# Altium project NBBC95水表.PrjPCB
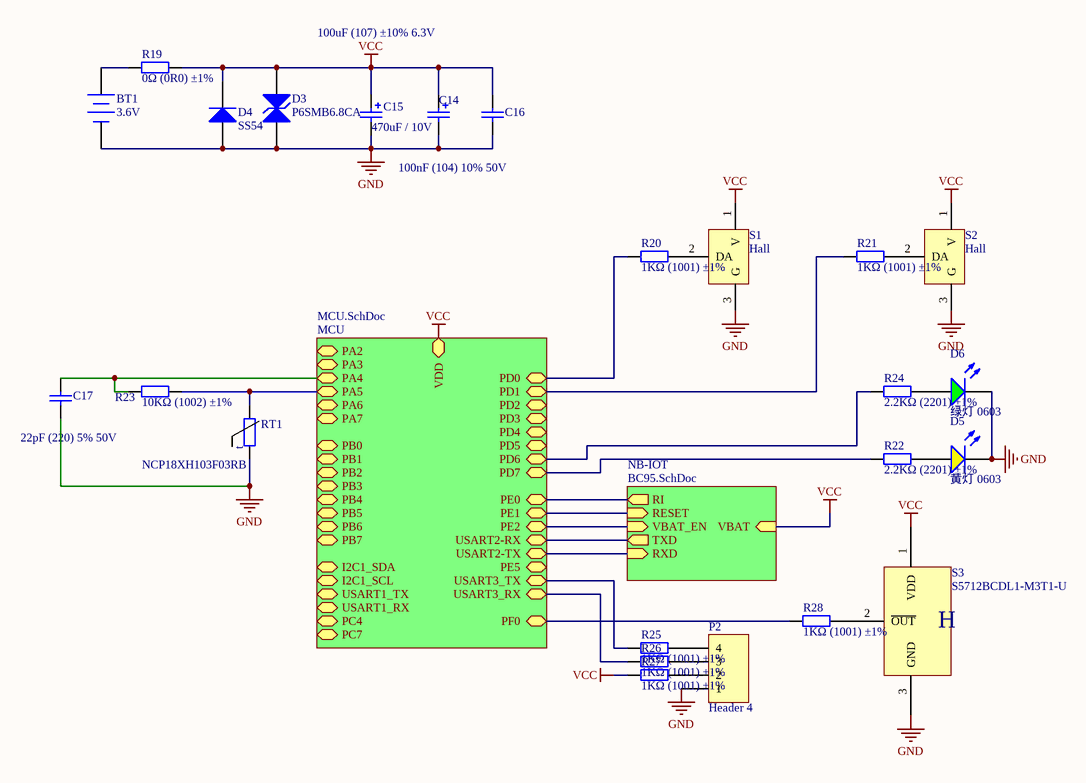
[diagram p0: NBBC95水表.SchDoc]
3 sheets, 71 parts. Net scope: hierarchical (ports join the sheet entries above them; power ports are global).
Board files: NBIOT水表主板.PcbDoc, 霍尔IC转接板.PcbDoc
Sheets:
  NBBC95水表.SchDoc
    MCU = MCU.SchDoc
    NB-IOT = BC95.SchDoc

## Sheet NBBC95水表.SchDoc
size A4

### Parts
BT1  3.6V  [电池连接焊线]
C14  100uF (107) ±10% 6.3V  [CASE-B_3528]
C15  470uF / 10V  [CASE-E_7343]
C16  100nF (104) 10% 50V  [0603_C]
C17  22pF (220) 5% 50V  [0603_C]
D3  P6SMB6.8CA  [SMB(DO-214AA)_S1]
D4  SS54  [SMA(DO-214AC)_S1]
D5  黄灯 0603  [0603_LED_S1]
D6  绿灯 0603  [0603_LED_S1]
P2  Header 4  [HDR1X4]
R19  0Ω (0R0) ±1%  [0805_R]
R20  1KΩ (1001) ±1%  [0603_R]
R21  1KΩ (1001) ±1%  [0603_R]
R22  2.2KΩ (2201) ±1%  [0603_R]
R23  10KΩ (1002) ±1%  [0603_R]
R24  2.2KΩ (2201) ±1%  [0603_R]
R25  1KΩ (1001) ±1%  [0603_R]
R26  1KΩ (1001) ±1%  [0603_R]
R27  1KΩ (1001) ±1%  [0603_R]
R28  1KΩ (1001) ±1%  [0603_R]
RT1  NCP18XH103F03RB  [0603_R]
S1  Hall  [霍尔转接板]
S2  Hall  [霍尔转接板]
S3  S5712BCDL1-M3T1-U  [SOT-23]

### Sub-sheets
MCU = MCU.SchDoc: PA2 (bidir), PA3 (bidir), PA4 (bidir), PA5 (bidir), PA6 (bidir), PA7 (bidir), PE0 (bidir), PE1 (bidir), PE2 (bidir), USART2-RX (bidir), USART2-TX (bidir), PE5 (bidir), PD0 (bidir), PD1 (bidir), PD2 (bidir), PD3 (bidir), PB0 (bidir), PB1 (bidir), PB2 (bidir), PB3 (bidir), PB4 (bidir), PB5 (bidir), PB6 (bidir), PB7 (bidir), PF0 (bidir), PD4 (bidir), PD5 (bidir), PD6 (bidir), PD7 (bidir), I2C1_SDA (bidir), I2C1_SCL (bidir), USART1_RX (bidir), USART1_TX (bidir), PC4 (bidir), PC7 (bidir), USART3_TX (bidir), USART3_RX (bidir), VDD
NB-IOT = BC95.SchDoc: VBAT (in), RESET (in), RXD (in), TXD (out), RI (out), VBAT_EN (in)

### Nets
GND: BT1.2(-) C14.2 C15.2 C16.2 C17.1 D3.1(A) D4.1(A) D5.K D6.K P2.1 RT1.1 S1.3(G) S2.3(G) S3.3(GND)
VCC: C14.1 C15.1 C16.1 D3.2(K) D4.2(K) R19.2 R27.2 S1.1(V) S2.1(V) S3.1(VDD) ; sheet MCU/VDD, sheet NB-IOT/VBAT
NetBT1_1: BT1.1(+) R19.1
NetC17_2: C17.2 R23.1 ; sheet MCU/PA4
NetD2_2: sheet MCU/USART2-TX, sheet NB-IOT/RXD
NetD5_A: D5.A R22.2
NetD6_A: D6.A R24.2
NetP2_2: P2.2 R27.1
NetP2_3: P2.3 R26.1
NetP2_4: P2.4 R25.1
NetQ4_3: sheet MCU/USART2-RX, sheet NB-IOT/TXD
NetQ5_3: sheet MCU/PE0, sheet NB-IOT/RI
NetR4_1: sheet MCU/PE2, sheet NB-IOT/VBAT_EN
NetR15_1: sheet MCU/PE1, sheet NB-IOT/RESET
NetR20_1: R20.1 ; sheet MCU/PD0
NetR20_2: R20.2 S1.2(DA)
NetR21_1: R21.1 ; sheet MCU/PD1
NetR21_2: R21.2 S2.2(DA)
NetR22_1: R22.1 ; sheet MCU/PD7
NetR23_2: R23.2 RT1.2 ; sheet MCU/PA5
NetR24_1: R24.1 ; sheet MCU/PD6
NetR25_2: R25.2 ; sheet MCU/USART3_TX
NetR26_2: R26.2 ; sheet MCU/USART3_RX
NetR28_1: R28.1 ; sheet MCU/PF0
NetR28_2: R28.2 S3.2(~{OUT})

### Notes on the sheet
- (in symbol NCP18XH103F03RB) t
- (in symbol S5712) H

### Library data of the parts
BT1 = Battery: 功率型锂电池; Published: 24-Mar-1999; LatestRevisionDate: 17-Jul-2002; LatestRevisionNote: Re-released for DXP Platform.; PackageReference: BAT-2; Publisher: Altium Limited
C14 = 3528 100uF (107) 10% 6.3V: 钽电容; ComponentLink1Description: 供应商链接; ComponentLink1URL: http://www.szlcsc.com/product/details_16815.html; Package: 3528; Supplier: LC; SuppliersPartNumber: C16133
C15 = 法拉电容 0.5F: 钽电容; ComponentLink1Description: 供应商链接; ComponentLink1URL: http://www.szlcsc.com/product/details_16815.html; Package: 3528; Supplier: LC; SuppliersPartNumber: C16133
C16 = 0603 100nF (104) 10% 50V: 贴片电容; ComponentLink1Description: 供应商链接; ComponentLink1URL: http://www.szlcsc.com/product/details_15331.html; Package: 0603; Supplier: LC; SuppliersPartNumber: C14663
C17 = 0603 22pF (220) 5% 50V: 贴片电容; ComponentLink1Description: 供应商链接; ComponentLink1URL: http://www.szlcsc.com/product/details_2005.html; Package: 0603; Supplier: LC; SuppliersPartNumber: C1653
D3 = SMB/DO-214AA P6SMB6.8CA: TVS; ComponentLink1Description: 供应商链接; ComponentLink1URL: http://www.szlcsc.com/product/details_79530.html; Package: SMB/DO-214AA; Supplier: LC; SuppliersPartNumber: C78395
D4 = SMA(DO-214AC) SS54: 二极管; ComponentLink1Description: 供应商链接; ComponentLink1URL: http://www.szlcsc.com/product/details_23178.html; Package: SMA(DO-214AC); Supplier: LC; SuppliersPartNumber: C22452
D5 = 0603 黄灯: 发光二极管; ComponentLink1Description: 供应商链接; ComponentLink1URL: http://www.szlcsc.com/product/details_73147.html; Package: 0603; Supplier: LC; SuppliersPartNumber: C72038
D6 = 0603 绿灯: 发光二极管; ComponentLink1Description: 供应商链接; ComponentLink1URL: http://www.szlcsc.com/product/details_73152.html; Package: 0603; Supplier: LC; SuppliersPartNumber: C72043
P2 = Header 4: Header, 4-Pin; LatestRevisionDate: 17-Jul-2002; LatestRevisionNote: Re-released for DXP Platform.; Publisher: Altium Limited
R19 = 0805 0Ω (0R0) 1%: 贴片电阻; ComponentLink1Description: 供应商链接; ComponentLink1URL: http://www.szlcsc.com/product/details_18165.html; Package: 0805; Supplier: LC; SuppliersPartNumber: C17477
R20 R21 R25-R28 = 0603 1KΩ (1001) 1%: 贴片电阻; ComponentLink1Description: 供应商链接; ComponentLink1URL: http://www.szlcsc.com/product/details_21904.html; Package: 0603; Supplier: LC; SuppliersPartNumber: C21190
R22 R24 = 0603 2.2KΩ (2201) 1%: 贴片电阻; ComponentLink1Description: 供应商链接; ComponentLink1URL: http://www.szlcsc.com/product/details_4597.html; Package: 0603; Supplier: LC; SuppliersPartNumber: C4190
R23 = 0603 10KΩ (1002) 1%: 贴片电阻; ComponentLink1Description: 供应商链接; ComponentLink1URL: http://www.szlcsc.com/product/details_26547.html; Package: 0603; Supplier: LC; SuppliersPartNumber: C25804
RT1 = NCP18XH103F03RB: 热敏电阻
S1 S2 = 霍尔开关转接板
S3 = S5712

## Sheet MCU.SchDoc
size A4
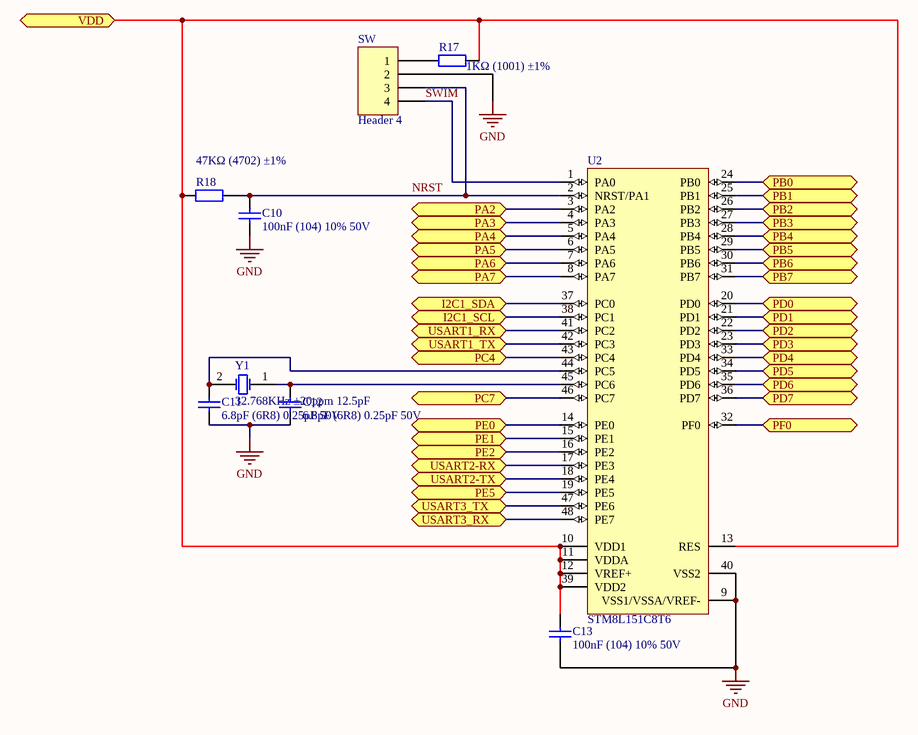
[diagram p1: MCU.SchDoc]

### Parts
C10  100nF (104) 10% 50V  [0603_C]
C11  6.8pF (6R8) 0.25pF 50V  [0603_C]
C12  6.8pF (6R8) 0.25pF 50V  [0603_C]
C13  100nF (104) 10% 50V  [0603_C]
R17  1KΩ (1001) ±1%  [0603_R]
R18  47KΩ (4702) ±1%  [0603_R]
SW  Header 4  [HDR1X4]
U2  STM8L151C8T6  [LQFP48_M]
Y1  32.768KHz ±20ppm 12.5pF  [SMD-3215_2P FC - 135]

### Ports
I2C1_SCL (bidir), I2C1_SDA (bidir), PA2 (bidir), PA3 (bidir), PA4 (bidir), PA5 (bidir), PA6 (bidir), PA7 (bidir), PB0 (bidir), PB1 (bidir), PB2 (bidir), PB3 (bidir), PB4 (bidir), PB5 (bidir), PB6 (bidir), PB7 (bidir), PC4 (bidir), PC7 (bidir), PD0 (bidir), PD1 (bidir), PD2 (bidir), PD3 (bidir), PD4 (bidir), PD5 (bidir), PD6 (bidir), PD7 (bidir), PE0 (bidir), PE1 (bidir), PE2 (bidir), PE5 (bidir), PF0 (bidir), USART1_RX (bidir), USART1_TX (bidir), USART2-RX (bidir), USART2-TX (bidir), USART3_RX (bidir), USART3_TX (bidir), VDD

### Nets
GND: C10.1 C11.1 C12.1 C13.1 SW.2 U2.9(VSS1/VSSA/VREF-) U2.40(VSS2)
VCC: C13.2 R17.2 R18.2 U2.10(VDD1) U2.11(VDDA) U2.12(VREF+) U2.13(RES) U2.39(VDD2) ; port VDD
NRST: C10.2 R18.1 SW.3 U2.2(NRST/PA1)
SWIM: SW.4 U2.1(PA0)
NetC11_2: C11.2 U2.44(PC5) Y1.2(OSC2)
NetC12_2: C12.2 U2.45(PC6) Y1.1(OSC1)
NetC17_2: U2.5(PA4) ; port PA4
NetD2_2: U2.18(PE4) ; port USART2-TX
NetQ4_3: U2.17(PE3) ; port USART2-RX
NetQ5_3: U2.14(PE0) ; port PE0
NetR4_1: U2.16(PE2) ; port PE2
NetR15_1: U2.15(PE1) ; port PE1
NetR17_1: R17.1 SW.1
NetR20_1: U2.20(PD0) ; port PD0
NetR21_1: U2.21(PD1) ; port PD1
NetR22_1: U2.36(PD7) ; port PD7
NetR23_2: U2.6(PA5) ; port PA5
NetR24_1: U2.35(PD6) ; port PD6
NetR25_2: U2.47(PE6) ; port USART3_TX
NetR26_2: U2.48(PE7) ; port USART3_RX
NetR28_1: U2.32(PF0) ; port PF0
NetU2_3: U2.3(PA2) ; port PA2
NetU2_4: U2.4(PA3) ; port PA3
NetU2_7: U2.7(PA6) ; port PA6
NetU2_8: U2.8(PA7) ; port PA7
NetU2_19: U2.19(PE5) ; port PE5
NetU2_22: U2.22(PD2) ; port PD2
NetU2_23: U2.23(PD3) ; port PD3
NetU2_24: U2.24(PB0) ; port PB0
NetU2_25: U2.25(PB1) ; port PB1
NetU2_26: U2.26(PB2) ; port PB2
NetU2_27: U2.27(PB3) ; port PB3
NetU2_28: U2.28(PB4) ; port PB4
NetU2_29: U2.29(PB5) ; port PB5
NetU2_30: U2.30(PB6) ; port PB6
NetU2_31: U2.31(PB7) ; port PB7
NetU2_33: U2.33(PD4) ; port PD4
NetU2_34: U2.34(PD5) ; port PD5
NetU2_37: U2.37(PC0) ; port I2C1_SDA
NetU2_38: U2.38(PC1) ; port I2C1_SCL
NetU2_41: U2.41(PC2) ; port USART1_RX
NetU2_42: U2.42(PC3) ; port USART1_TX
NetU2_43: U2.43(PC4) ; port PC4
NetU2_46: U2.46(PC7) ; port PC7

### Library data of the parts
C10 C13 = 0603 100nF (104) 10% 50V: 贴片电容; ComponentLink1Description: 供应商链接; ComponentLink1URL: http://www.szlcsc.com/product/details_15331.html; Package: 0603; Supplier: LC; SuppliersPartNumber: C14663
C11 C12 = 0603 6.8pF (6R8) 0.25pF 50V: 贴片电容; ComponentLink1Description: 供应商链接; ComponentLink1URL: http://www.szlcsc.com/product/details_2031.html; Package: 0603; Supplier: LC; SuppliersPartNumber: C1679
R17 = 0603 1KΩ (1001) 1%: 贴片电阻; ComponentLink1Description: 供应商链接; ComponentLink1URL: http://www.szlcsc.com/product/details_21904.html; Package: 0603; Supplier: LC; SuppliersPartNumber: C21190
R18 = 0603 100KΩ (1003) 1%: 贴片电阻; ComponentLink1Description: 供应商链接; ComponentLink1URL: http://www.szlcsc.com/product/details_26546.html; Package: 0603; Supplier: LC; SuppliersPartNumber: C25803
SW = Header 4: Header, 4-Pin; LatestRevisionDate: 17-Jul-2002; LatestRevisionNote: Re-released for DXP Platform.; Publisher: Altium Limited
U2 = STM8L151C8T6: STM8L ARM-based EnergyLite 8-bit MCU, 64 kB Flash, 4 kB Internal RAM, -40 to +85°C Temperature, 48-pin LQFP, Tray; PackageVersion: rev13, Apr-2011; PackageReference: LQFP48; PackageDescription: 48-Pin Low-Profile Quad Flat Pack, 7 x 7 mm Body, 0.5 mm Pitch (LQFP48); ComponentLink1Description: Manufacturer URL; ComponentLink1URL: http://www.st.com/; ComponentLink2Description: STM8L151/152,x8,R6 Datasheet; ComponentLink2URL: http://www.st.com/internet/com/TECHNICAL_RESOURCES/TECHNICAL_LITERATURE/DATASHEET/CD00284933.pdf; ComponentLink3Description: STM8L Family Web Page; ComponentLink3URL: http://www.st.com/internet/mcu/subclass/1381.jsp
Y1 = SMD-3215_2P 32.768KHz 20ppm 12.5pF: 贴片晶振; ComponentLink1Description: 供应商链接; ComponentLink1URL: http://www.szlcsc.com/product/details_33310.html; Package: SMD-3215_2P; Supplier: LC; SuppliersPartNumber: C32346

## Sheet BC95.SchDoc
size A4
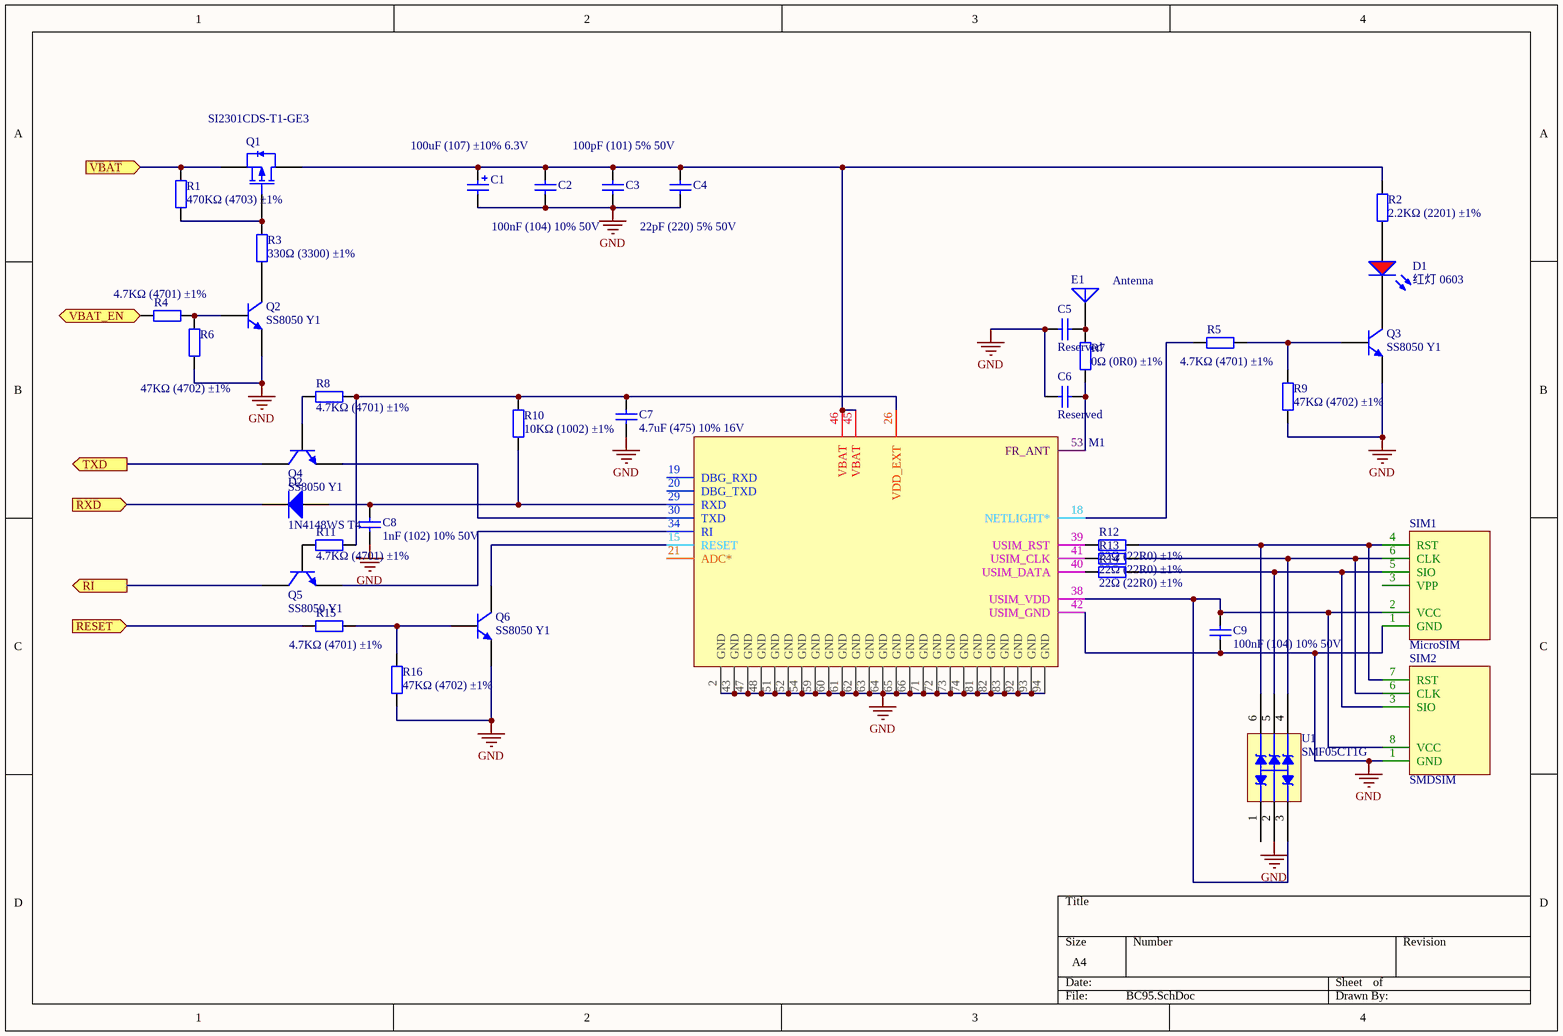
[diagram p2: BC95.SchDoc]

### Parts
C1  100uF (107) ±10% 6.3V  [CASE-B_3528]
C2  100nF (104) 10% 50V  [0603_C]
C3  100pF (101) 5% 50V  [0603_C]
C4  22pF (220) 5% 50V  [0603_C]
C5  Reserved  [0603_C]
C6  Reserved  [0603_C]
C7  4.7uF (475) 10% 16V  [0603_C]
C8  1nF (102) 10% 50V  [0603_C]
C9  100nF (104) 10% 50V  [0603_C]
D1  红灯 0603  [0603_LED_S1]
D2  1N4148WS T4  [SOD-323]
E1  Antenna  [PIN1]
M1  BC95-B5  [BC95-B]  (value not drawn)
Q1  SI2301CDS-T1-GE3  [SOT-23(SOT-23-3)]
Q2  SS8050 Y1  [SOT-23(SOT-23-3)]
Q3  SS8050 Y1  [SOT-23(SOT-23-3)]
Q4  SS8050 Y1  [SOT-23(SOT-23-3)]
Q5  SS8050 Y1  [SOT-23(SOT-23-3)]
Q6  SS8050 Y1  [SOT-23(SOT-23-3)]
R1  470KΩ (4703) ±1%  [0603_R]
R2  2.2KΩ (2201) ±1%  [0603_R]
R3  330Ω (3300) ±1%  [0603_R]
R4  4.7KΩ (4701) ±1%  [0603_R]
R5  4.7KΩ (4701) ±1%  [0603_R]
R6  47KΩ (4702) ±1%  [0603_R]
R7  0Ω (0R0) ±1%  [0603_R]
R8  4.7KΩ (4701) ±1%  [0603_R]
R9  47KΩ (4702) ±1%  [0603_R]
R10  10KΩ (1002) ±1%  [0603_R]
R11  4.7KΩ (4701) ±1%  [0603_R]
R12  22Ω (22R0) ±1%  [0603_R]
R13  22Ω (22R0) ±1%  [0603_R]
R14  22Ω (22R0) ±1%  [0603_R]
R15  4.7KΩ (4701) ±1%  [0603_R]
R16  47KΩ (4702) ±1%  [0603_R]
SIM1  MicroSIM  [SIM-01A]
SIM2  SMDSIM  [VQFN48]
U1  SMF05CT1G  [SC-70-6(SOT-363)]

### Ports
RESET (in), RI (out), RXD (in), TXD (out), VBAT (in), VBAT_EN (in)

### Nets
GND: C1.2 C2.2 C3.1 C4.1 C5.1 C6.1 C7.1 C8.1 C9.1 M1.2(GND) M1.42(USIM_GND) M1.43(GND) M1.47(GND) M1.48(GND) M1.51(GND) M1.52(GND) M1.54(GND) M1.59(GND) M1.60(GND) M1.61(GND) M1.62(GND) M1.63(GND) M1.64(GND) M1.65(GND) M1.66(GND) M1.71(GND) M1.72(GND) M1.73(GND) M1.74(GND) M1.81(GND) M1.82(GND) M1.83(GND) M1.92(GND) M1.93(GND) M1.94(GND) Q2.2(E) Q3.2(E) Q6.2(E) R6.1 R9.1 R16.1 SIM1.1(GND) SIM2.1(GND) U1.2
VCC: Q1.2(S) R1.1 ; port VBAT
NetC1_1: C1.1 C2.1 C3.2 C4.2 M1.45(VBAT) M1.46(VBAT) Q1.3(D) R2.2
NetC5_2: C5.2 E1.1(A) R7.2
NetC6_2: C6.2 M1.53(FR_ANT) R7.1
NetC7_2: C7.2 M1.26(VDD_EXT) R8.1 R10.1 R11.2
NetC8_2: C8.2 D2.1(A) M1.29(RXD) R10.2
NetC9_2: C9.2 M1.38(USIM_VDD) SIM1.2(VCC) SIM2.8(VCC) U1.3
NetD1_A: D1.A R2.1
NetD1_K: D1.K Q3.3(C)
NetD2_2: D2.2(K) ; port RXD
NetM1_15: M1.15(RESET) Q6.3(C)
NetM1_18: M1.18(NETLIGHT*) R5.1
NetM1_30: M1.30(TXD) Q4.2(E)
NetM1_34: M1.34(RI) Q5.2(E)
NetM1_39: M1.39(USIM_RST) R12.1
NetM1_40: M1.40(USIM_DATA) R14.1
NetM1_41: M1.41(USIM_CLK) R13.1
NetQ1_1: Q1.1(G) R1.2 R3.2
NetQ2_1: Q2.1(B) R4.2 R6.2
NetQ2_3: Q2.3(C) R3.1
NetQ3_1: Q3.1(B) R5.2 R9.2
NetQ4_1: Q4.1(B) R8.2
NetQ4_3: Q4.3(C) ; port TXD
NetQ5_1: Q5.1(B) R11.1
NetQ5_3: Q5.3(C) ; port RI
NetQ6_1: Q6.1(B) R15.2 R16.2
NetR4_1: R4.1 ; port VBAT_EN
NetR12_2: R12.2 SIM1.4(RST) SIM2.7(RST) U1.6
NetR13_2: R13.2 SIM1.6(CLK) SIM2.6(CLK) U1.4
NetR14_2: R14.2 SIM1.5(SIO) SIM2.3(SIO) U1.5
NetR15_1: R15.1 ; port RESET

Not connected (* = marked no-connect by the designer): M1 1(RESERVED) 3(RESERVED) 4(RESERVED) 5(RESERVED) 6(RESERVED) 7(RESERVED) 8(RESERVED) 9(RESERVED) 10(RESERVED) 11(RESERVED) 12(RESERVED) 13(RESERVED) 14(RESERVED) 16(RESERVED) 17(RESERVED) 19(DBG_RXD) 20(DBG_TXD) 21(ADC*) 22(RESERVED) 23(RESERVED) 24(RESERVED) 25(RESERVED) 27(RESERVED) 28(RESERVED) 31(RESERVED) 32(RESERVED) 33(RESERVED) 35(RESERVED) 36(RESERVED) 37(RESERVED) 44(RESERVED) 49(RESERVED) 50(RESERVED) 55(RESERVED) 56(RESERVED) 57(RESERVED) 58(RESERVED) 67(RESERVED) 68(RESERVED) 69(RESERVED) 70(RESERVED) 75(RESERVED) 76(RESERVED) 77(RESERVED) 78(RESERVED) 79(RESERVED) 80(RESERVED) 84(RESERVED) 85(RESERVED) 86(RESERVED) 87(RESERVED) 88(RESERVED) 89(RESERVED) 90(RESERVED) 91(RESERVED); SIM1 3(VPP); SIM2 2(NC) 4(NC) 5(NC); U1 1

### Library data of the parts
C1 = 3528 100uF (107) 10% 6.3V: 钽电容; ComponentLink1Description: 供应商链接; ComponentLink1URL: http://www.szlcsc.com/product/details_16815.html; Package: 3528; Supplier: LC; SuppliersPartNumber: C16133
C2 C9 = 0603 100nF (104) 10% 50V: 贴片电容; ComponentLink1Description: 供应商链接; ComponentLink1URL: http://www.szlcsc.com/product/details_15331.html; Package: 0603; Supplier: LC; SuppliersPartNumber: C14663
C3 = 0603 100pF (101) 5% 50V: 贴片电容; ComponentLink1Description: 供应商链接; ComponentLink1URL: http://www.szlcsc.com/product/details_15530.html; Package: 0603; Supplier: LC; SuppliersPartNumber: C14858
C4-C6 = 0603 22pF (220) 5% 50V: 贴片电容; ComponentLink1Description: 供应商链接; ComponentLink1URL: http://www.szlcsc.com/product/details_2005.html; Package: 0603; Supplier: LC; SuppliersPartNumber: C1653
C7 = 0603 4.7uF (475) 10% 16V: 贴片电容; ComponentLink1Description: 供应商链接; ComponentLink1URL: http://www.szlcsc.com/product/details_20375.html; Package: 0603; Supplier: LC; SuppliersPartNumber: C19666
C8 = 0603 1nF (102) 10% 50V: 贴片电容; ComponentLink1Description: 供应商链接; ComponentLink1URL: http://www.szlcsc.com/product/details_1940.html; Package: 0603; Supplier: LC; SuppliersPartNumber: C1588
D1 = 0603 红灯: 发光二极管; ComponentLink1Description: 供应商链接; ComponentLink1URL: http://www.szlcsc.com/product/details_2659.html; Package: 0603; Supplier: LC; SuppliersPartNumber: C2286
D2 = SOD-323 1N4148WS T4: 二极管; ComponentLink1Description: 供应商链接; ComponentLink1URL: http://www.szlcsc.com/product/details_2485.html; Package: SOD-323; Supplier: LC; SuppliersPartNumber: C2128
E1 = Antenna: Generic Antenna; Published: 24-Mar-1999; LatestRevisionDate: 17-Jul-2002; LatestRevisionNote: Re-released for DXP Platform.; PackageReference: PIN1; Publisher: Altium Limited
M1 = BC95-B5: NB-IOT模块 电信
Q1 = SI2301CDS-T1-GE3: MOS(场效应管); ComponentLink1Description: 供应商链接; ComponentLink1URL: http://www.szlcsc.com/product/details_11030.html; Package: SOT-23(SOT-23-3); Supplier: LC; SuppliersPartNumber: C10487
Q2-Q6 = SOT-23 SS8050 Y1: 三极管; ComponentLink1Description: 供应商链接; ComponentLink1URL: http://www.szlcsc.com/product/details_2507.html; Package: SOT-23; Supplier: LC; SuppliersPartNumber: C2150
R1 = 0603 470KΩ (4703) 1%: 贴片电阻; ComponentLink1Description: 供应商链接; ComponentLink1URL: http://www.szlcsc.com/product/details_23905.html; Package: 0603; Supplier: LC; SuppliersPartNumber: C23178
R2 = 0603 2.2KΩ (2201) 1%: 贴片电阻; ComponentLink1Description: 供应商链接; ComponentLink1URL: http://www.szlcsc.com/product/details_4597.html; Package: 0603; Supplier: LC; SuppliersPartNumber: C4190
R3 = 0603 330Ω (3300) 1%: 贴片电阻; ComponentLink1Description: 供应商链接; ComponentLink1URL: http://www.szlcsc.com/product/details_23865.html; Package: 0603; Supplier: LC; SuppliersPartNumber: C23138
R4 R5 R8 R11 R15 = 0603 4.7KΩ (4701) 1%: 贴片电阻; ComponentLink1Description: 供应商链接; ComponentLink1URL: http://www.szlcsc.com/product/details_23889.html; Package: 0603; Supplier: LC; SuppliersPartNumber: C23162
R6 R9 R16 = 0603 47KΩ (4702) 1%: 贴片电阻; ComponentLink1Description: 供应商链接; ComponentLink1URL: http://www.szlcsc.com/product/details_26562.html; Package: 0603; Supplier: LC; SuppliersPartNumber: C25819
R7 = 0603 0Ω (0R0) 1%: 贴片电阻; ComponentLink1Description: 供应商链接; ComponentLink1URL: http://www.szlcsc.com/product/details_21903.html; Package: 0603; Supplier: LC; SuppliersPartNumber: C21189
R10 = 0603 10KΩ (1002) 1%: 贴片电阻; ComponentLink1Description: 供应商链接; ComponentLink1URL: http://www.szlcsc.com/product/details_26547.html; Package: 0603; Supplier: LC; SuppliersPartNumber: C25804
R12-R14 = 0603 22Ω (22R0) 1%: 贴片电阻; ComponentLink1Description: 供应商链接; ComponentLink1URL: http://www.szlcsc.com/product/details_24078.html; Package: 0603; Supplier: LC; SuppliersPartNumber: C23345
SIM1 = MicroSIM: MicroSIM卡座
SIM2 = SMDSIM: SMDSIM芯片
U1 = SMF05CT1G: TVS; ComponentLink1Description: 供应商链接; ComponentLink1URL: http://www.szlcsc.com/product/details_16561.html; Package: SC-70-6(SOT-363); Supplier: LC; SuppliersPartNumber: C15879

## Nets that join several sheets
GND: NBBC95水表 (14 pins), MCU (7 pins), BC95 (44 pins)
VCC: NBBC95水表 (10 pins), MCU (8 pins), BC95 (Q1.2 R1.1)
NetC17_2: NBBC95水表 (C17.2 R23.1), MCU (U2.5)
NetD2_2: MCU (U2.18), BC95 (D2.2)
NetQ4_3: MCU (U2.17), BC95 (Q4.3)
NetQ5_3: MCU (U2.14), BC95 (Q5.3)
NetR4_1: MCU (U2.16), BC95 (R4.1)
NetR15_1: MCU (U2.15), BC95 (R15.1)
NetR20_1: NBBC95水表 (R20.1), MCU (U2.20)
NetR21_1: NBBC95水表 (R21.1), MCU (U2.21)
NetR22_1: NBBC95水表 (R22.1), MCU (U2.36)
NetR23_2: NBBC95水表 (R23.2 RT1.2), MCU (U2.6)
NetR24_1: NBBC95水表 (R24.1), MCU (U2.35)
NetR25_2: NBBC95水表 (R25.2), MCU (U2.47)
NetR26_2: NBBC95水表 (R26.2), MCU (U2.48)
NetR28_1: NBBC95水表 (R28.1), MCU (U2.32)